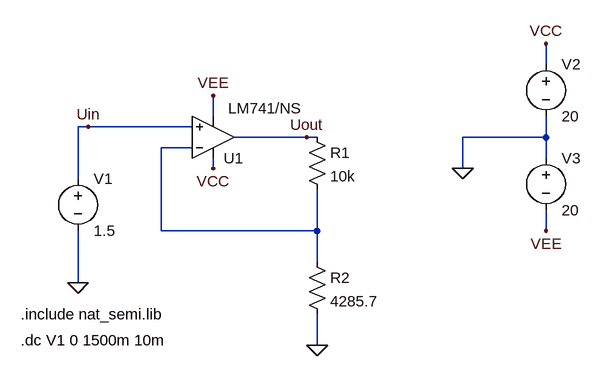
[diagram p0: schematic analog_input.asc]
analog_input.asc, the LTspice schematic file:
Version 4
SHEET 1 880 680
WIRE 720 -48 720 -80
WIRE 208 32 208 0
WIRE 16 48 0 48
WIRE 176 48 16 48
WIRE 352 64 240 64
WIRE 368 64 352 64
WIRE 720 64 720 32
WIRE 720 64 592 64
WIRE 176 80 128 80
WIRE 720 96 720 64
WIRE 208 112 208 96
WIRE 592 112 592 64
WIRE 0 128 0 48
WIRE 128 208 128 80
WIRE 368 208 368 144
WIRE 368 208 128 208
WIRE 720 208 720 176
WIRE 368 256 368 208
WIRE 0 288 0 208
WIRE 368 384 368 336
FLAG 0 288 0
FLAG 368 384 0
FLAG 720 -80 VCC
FLAG 720 208 VEE
FLAG 592 112 0
FLAG 208 0 VEE
FLAG 16 48 Uin
FLAG 352 64 Uout
FLAG 208 112 VCC
SYMBOL Opamps\\opamp2 208 128 M180
WINDOW 3 23 109 Left 2
SYMATTR InstName U1
SYMATTR Value LM741/NS
SYMBOL voltage 0 112 R0
SYMATTR InstName V1
SYMATTR Value 1.5
SYMBOL res 352 48 R0
SYMATTR InstName R1
SYMATTR Value 10k
SYMBOL res 352 240 R0
SYMATTR InstName R2
SYMATTR Value 4285.7
SYMBOL voltage 720 -64 R0
SYMATTR InstName V2
SYMATTR Value 20
SYMBOL voltage 720 80 R0
SYMATTR InstName V3
SYMATTR Value 20
TEXT -88 336 Left 2 !.include nat_semi.lib
TEXT -88 376 Left 2 !.dc V1 0 1500m 10m

The netlist it stands for:
* analog_input.asc
XU1 Uin N001 VCC VEE Uout LM741/NS  ; pins In+ In- V+ V- OUT
V1 Uin 0 1.5
R1 Uout N001 10k
R2 N001 0 4285.7
V2 VCC 0 20
V3 0 VEE 20
.include nat_semi.lib
.dc V1 0 1500m 10m
.backanno
.end

* Results of the author's LTspice run, read from the files saved beside the schematic
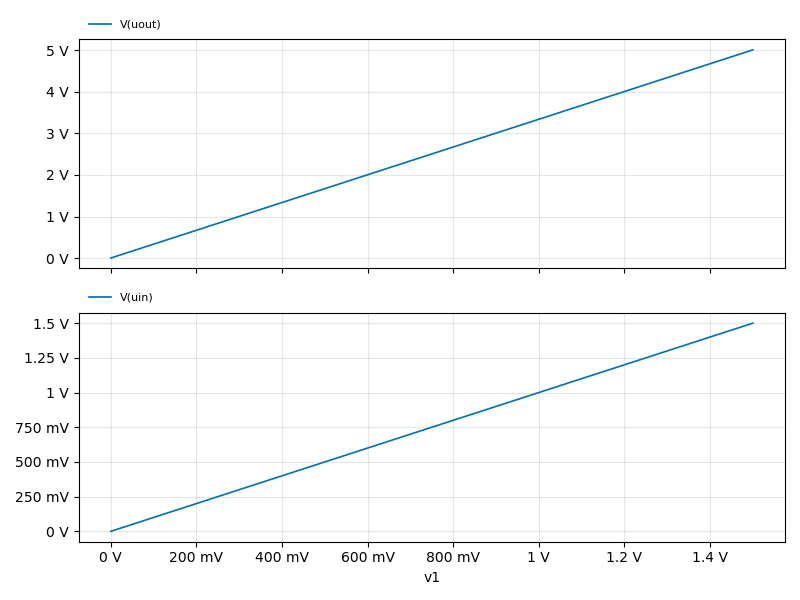
[diagram p1: DC transfer characteristic of analog_input.asc, plotted from the saved traces]
* DC transfer characteristic, 1 run:
*   V(uout): 4.352 mV at v1=0 V, 5.004 V at v1=1.5 V, min 4.352 mV, max 5.004 V
*   V(uin): 0 V at v1=0 V, 1.5 V at v1=1.5 V, min 0 V, max 1.5 V